# EAGLE design tricorder-sensors-mk-2.0 (EAGLE 7.5.0)
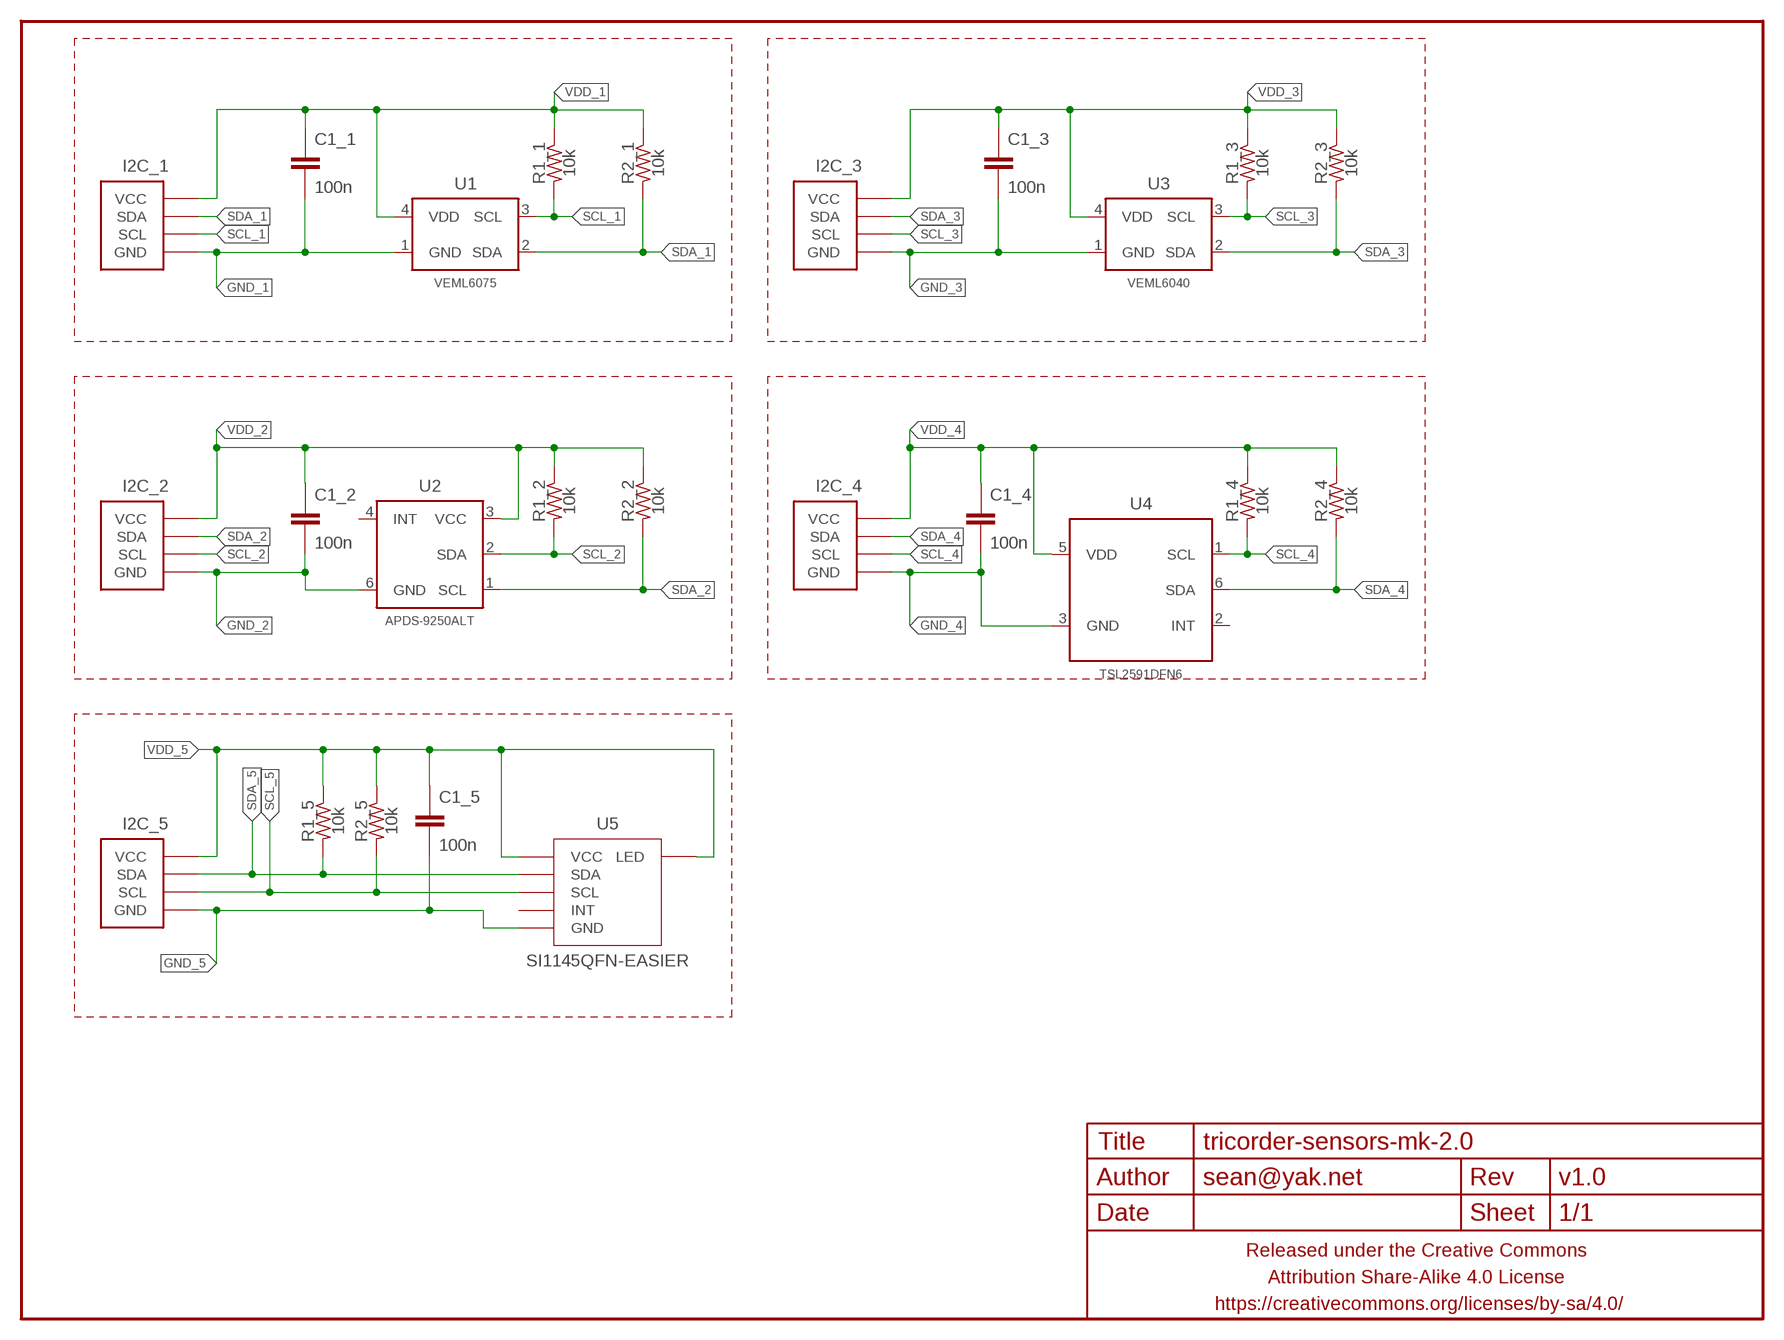
[diagram p0: schematic, sheet 1]

## Parts
C1_1  100n  CAPACITOR-CERAMICC0603  [C0603]
C1_2  100n  CAPACITOR-CERAMICC0603  [C0603]
C1_3  100n  CAPACITOR-CERAMICC0603  [C0603]
C1_4  100n  CAPACITOR-CERAMICC0603  [C0603]
C1_5  100n  CAPACITOR-CERAMICC0603  [C0603]
FRAME1  FRAME-LETTERNO_PACKAGE  [DUMMY]
I2C_1  M04-I2CPTH-0.1IN-CENTERED  [1X04-PTH-VERT-I2C-CENTERED]
I2C_2  M04-I2CPTH-0.1IN-CENTERED  [1X04-PTH-VERT-I2C-CENTERED]
I2C_3  M04-I2CPTH-0.1IN-CENTERED  [1X04-PTH-VERT-I2C-CENTERED]
I2C_4  M04-I2CPTH-0.1IN-CENTERED  [1X04-PTH-VERT-I2C-CENTERED]
I2C_5  M04-I2CPTH-0.1IN-CENTERED  [1X04-PTH-VERT-I2C-CENTERED]
R1_1  10k  RESISTORR0603  [R0603]
R1_2  10k  RESISTORR0603  [R0603]
R1_3  10k  RESISTORR0603  [R0603]
R1_4  10k  RESISTORR0603  [R0603]
R1_5  10k  RESISTORR0603  [R0603]
R2_1  10k  RESISTORR0603  [R0603]
R2_2  10k  RESISTORR0603  [R0603]
R2_3  10k  RESISTORR0603  [R0603]
R2_4  10k  RESISTORR0603  [R0603]
R2_5  10k  RESISTORR0603  [R0603]
U1  VEML6075  [OPLGA4]
U2  APDS-9250ALT  [APDS-9250-ALT]
U3  VEML6040  [OPLGA4]
U4  TSL2591DFN6  [TSL2951_DFN6]
U5  SI1145QFN-EASIER  [SI1145-ALT]

## Nets
GND_1: C1_1.2 I2C_1.GND U1.1(GND)
GND_2: C1_2.2 I2C_2.GND U2.6(GND)
GND_3: C1_3.2 I2C_3.GND U3.1(GND)
GND_4: C1_4.2 I2C_4.GND U4.3(GND)
GND_5: C1_5.2 I2C_5.GND U5.GND
SCL_1: I2C_1.SCL R1_1.2 U1.3(SCL)
SCL_2: I2C_2.SCL R1_2.2 U2.2(SDA)
SCL_3: I2C_3.SCL R1_3.2 U3.3(SCL)
SCL_4: I2C_4.SCL R1_4.2 U4.1(SCL)
SCL_5: I2C_5.SCL R2_5.2 U5.SCL
SDA_1: I2C_1.SDA R2_1.2 U1.2(SDA)
SDA_2: I2C_2.SDA R2_2.2 U2.1(SCL)
SDA_3: I2C_3.SDA R2_3.2 U3.2(SDA)
SDA_4: I2C_4.SDA R2_4.2 U4.6(SDA)
SDA_5: I2C_5.SDA R1_5.2 U5.SDA
VDD_1: C1_1.1 I2C_1.VCC R1_1.1 R2_1.1 U1.4(VDD)
VDD_2: C1_2.1 I2C_2.VCC R1_2.1 R2_2.1 U2.3(VCC)
VDD_3: C1_3.1 I2C_3.VCC R1_3.1 R2_3.1 U3.4(VDD)
VDD_4: C1_4.1 I2C_4.VCC R1_4.1 R2_4.1 U4.5(VDD)
VDD_5: C1_5.1 I2C_5.VCC R1_5.1 R2_5.1 U5.LED U5.VCC@1(VCC) U5.VCC@2(VCC)
Unconnected: U2.4(INT) U4.2(INT) U5.INT

## Library data of the parts
C1_1-C1_5 = a_parts:CAPACITOR-CERAMIC: CAPACITOR, European symbol
FRAME1 = a_parts:FRAME-LETTER: Schematic Frame Standard 8.5x11 US Letter frame; DESIGNER: sean@yak.net; VERSION: v1.0
I2C_1-I2C_5 = a_parts:M04-I2C
R1_1-R1_5 R2_1-R2_5 = a_parts:RESISTOR: RESISTOR, American symbol
U1 = a_parts:VEML6075
U2 = a_parts:APDS-9250
U3 = a_parts:VEML6040
U4 = a_parts:TSL2591
U5 = a_parts:SI1145

## Module SENSOR_VEML6075
Ports: 

### Library data of the parts

## Board
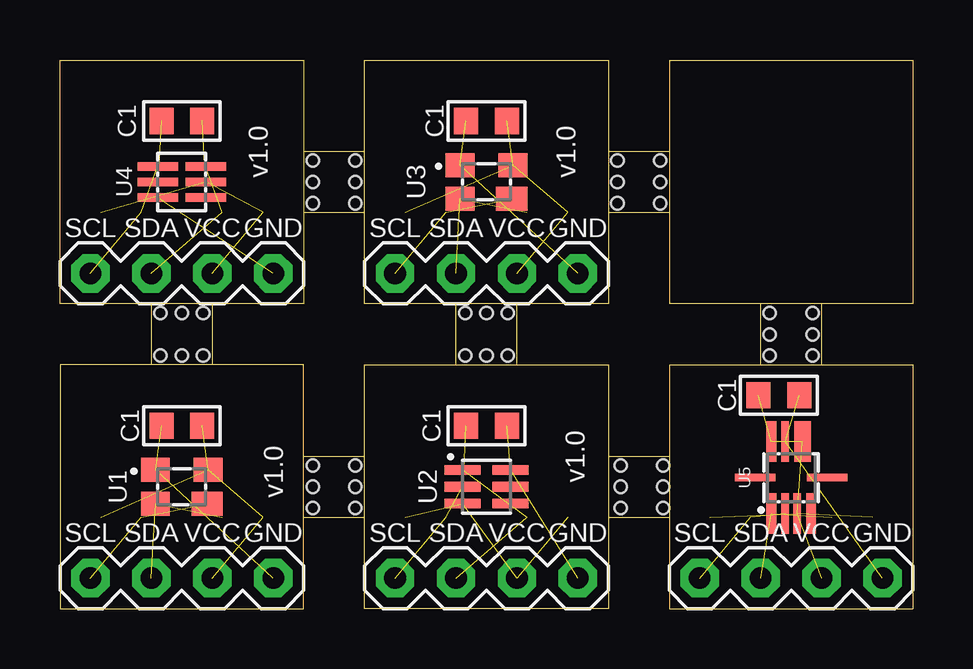
[diagram p1: board, top side]
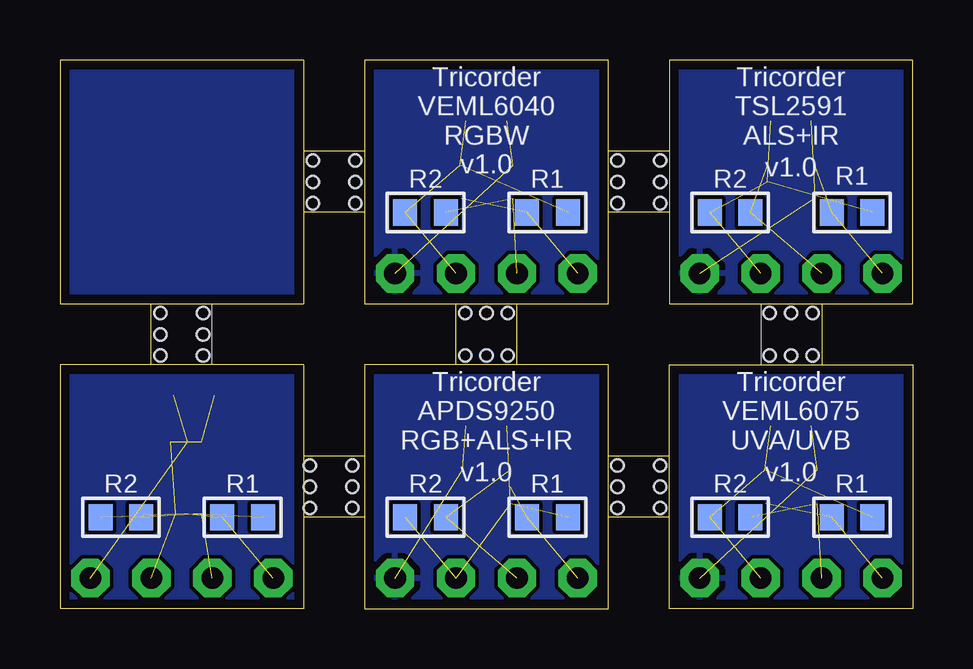
[diagram p2: board, bottom side, seen from below]

Size 35.56 x 22.86 mm. Coordinates in mm from the lower left corner, seen from the top.
Outline: 10.16,3.81 10.16,0 0,0 0,10.16 3.81,10.16
Outline: 10.16,3.81 10.16,6.35
Outline: 10.16,6.35 10.16,10.16 6.35,10.16
Outline: 6.35,10.16 3.81,10.16
Outline: 12.7,3.81 12.7,0 22.86,0 22.86,3.81
Outline: 12.7,3.81 12.7,6.35
Outline: 12.7,6.35 12.7,10.16 16.51,10.16
Outline: 16.51,10.16 19.05,10.16
Outline: 19.05,10.16 22.86,10.16 22.86,6.35
Outline: 22.86,6.35 22.86,3.81
Outline: 22.86,19.05 22.86,22.86 12.7,22.86 12.7,19.05
Outline: 22.86,19.05 22.86,16.51
Outline: 22.86,16.51 22.86,12.7 19.05,12.7
Outline: 19.05,12.7 16.51,12.7
Outline: 16.51,12.7 12.7,12.7 12.7,16.51
Outline: 12.7,16.51 12.7,19.05
Outline: 10.16,19.05 10.16,22.86 0,22.86 0,12.7 3.81,12.7
Outline: 10.16,19.05 10.16,16.51
Outline: 10.16,16.51 10.16,12.7 6.35,12.7
Outline: 6.35,12.7 3.81,12.7
Outline: 3.81,12.7 3.81,10.16
Outline: 6.35,12.7 6.35,10.16
Outline: 10.16,6.35 12.7,6.35
Outline: 10.16,3.81 12.7,3.81
Outline: 10.16,16.51 12.7,16.51
Outline: 10.16,19.05 12.7,19.05
Outline: 19.05,10.16 19.05,12.7
Outline: 16.51,10.16 16.51,12.7
Outline: 25.4,6.35 25.4,10.16 29.21,10.16
Outline: 25.4,6.35 25.4,3.81
Outline: 25.4,3.81 25.4,0 35.56,0 35.56,10.16 31.75,10.16
Outline: 29.21,10.16 31.75,10.16
Outline: 22.86,6.35 25.4,6.35
Outline: 22.86,3.81 25.4,3.81
Outline: 29.21,10.16 29.21,12.7
Outline: 31.75,10.16 31.75,12.7
Outline: 29.21,12.7 25.4,12.7 25.4,16.51
Outline: 31.75,12.7 35.56,12.7 35.56,22.86 25.4,22.86 25.4,19.05
Outline: 31.75,12.7 29.21,12.7
Outline: 25.4,19.05 25.4,16.51
Outline: 22.86,19.05 25.4,19.05
Outline: 22.86,16.51 25.4,16.51
Copper layers (1*16): Top 0.0356mm / dielectric 1.5011mm / Bottom 0.0356mm
Design rules "LaenPCBOrder2": minimum track width 6mil, minimum drill 13mil, track to track 6mil, track to pad 6mil, pad to pad 6mil, via to via 6mil, smd to smd 6mil, copper to edge 15mil, drill to drill 6mil, minimum pad ring 7mil, minimum via ring 7mil, stop-mask expansion 3mil, vias tented up to drill 20mil, thermal gap 10mil
Holes 0.51 mm at 5.08,12.32 4.19,12.32 5.97,12.32 4.19,10.54 5.08,10.54 5.97,10.54 10.54,5.08 10.54,4.19 10.54,5.97 12.32,4.19 12.32,5.08 12.32,5.97 10.54,17.78 10.54,16.89 10.54,18.67 12.32,16.89 12.32,17.78 12.32,18.67 17.78,10.54 18.67,10.54 16.89,10.54 18.67,12.32 17.78,12.32 16.89,12.32 23.37,5.08 23.37,4.19 23.37,5.97 25.15,4.19 25.15,5.08 25.15,5.97 29.59,11.43 29.59,10.54 29.59,12.32 31.37,10.54 31.37,11.43 31.37,12.32 23.24,17.78 23.24,16.89 23.24,18.67 25.02,16.89 25.02,17.78 25.02,18.67

### Footprints (pad centres in the part's own frame; a part is rotated, then mirrored left to right if it is on the bottom)
C0603 = smd 1 x 1.1: 1 -0.85,0; 2 0.85,0
1X04-PTH-VERT-I2C-CENTERED = drill 0.9 pad 1.6 octagon: GND -3.81,0; SCL 3.81,0; SDA 1.27,0; VCC -1.27,0
R0603 = smd 1 x 1.1: 1 -0.85,0; 2 0.85,0
OPLGA4 = smd 1.2 x 1: 1 -1.1,0.7; 2 -1.1,-0.7; 4 1.1,0.7 | smd 1.3 x 1: 3 1.05,-0.7
APDS-9250-ALT = smd 1.5 x 0.4: 1 -1,0.7; 2 -1,0; 3 -1,-0.7; 4 1,-0.7; 5 1,0; 6 1,0.7
TSL2951_DFN6 = smd 1.7 x 0.35: 1 -1,0.65; 2 -1,0; 3 -1,-0.65; 4 1,-0.65; 5 1,0; 6 1,0.65
SI1145-ALT = smd 1.7 x 0.3: GND 1.5,0.25; SCL -1.5,0.25; VCC@1 -1.5,-0.25 | smd 1.7 x 0.4: INT -1.5,-0.825; LED 1.5,0.825; SDA -1.5,0.825 | smd 0.3 x 1.7: NC@1 0,1.5; NC@2 0,-1.5 | smd 1.7 x 0.7: VCC@2 1.5,-0.475

### Placement (x,y rotation side)
C1_1  5.08,7.62 180 top
C1_2  17.78,7.62 0 top
C1_3  17.78,20.32 180 top
C1_4  5.08,20.32 180 top
C1_5  29.97,8.89 0 top
FRAME1  0,0 0 top
I2C_1  5.08,1.27 180 top
I2C_2  17.78,1.27 180 top
I2C_3  17.78,13.97 180 top
I2C_4  5.08,13.97 180 top
I2C_5  30.48,1.27 180 top
R1_1  2.54,3.81 180 bottom
R1_2  15.24,3.81 180 bottom
R1_3  15.24,16.51 180 bottom
R1_4  2.54,16.51 180 bottom
R1_5  33.02,3.81 0 bottom
R2_1  7.62,3.81 0 bottom
R2_2  20.32,3.81 0 bottom
R2_3  20.32,16.51 0 bottom
R2_4  7.62,16.51 0 bottom
R2_5  27.94,3.81 180 bottom
U1  5.08,5.08 0 top
U2  17.78,5.08 0 top
U3  17.78,17.78 0 top
U4  5.08,17.78 0 top
U5  30.48,5.46 90 top

### Tracks (layer width: path | path; a pad name or v marks a point on that pad's centre or on a via)
GND_1  (2 unrouted)
  pour Bottom: 0,10.16 0,0 10.16,0 10.16,10.16
GND_2  (2 unrouted)
  pour Bottom: 12.7,10.16 12.7,0 22.86,0 22.86,10.16
  pour Bottom: 25.4,10.16 25.4,0 35.56,0 35.56,10.16
GND_3  (2 unrouted)
  pour Bottom: 12.7,22.86 12.7,12.7 22.86,12.7 22.86,22.86
  pour Bottom: 25.4,22.86 25.4,12.7 35.56,12.7 35.56,22.86
GND_4  (2 unrouted)
  pour Bottom: 0,22.86 0,12.7 10.16,12.7 10.16,22.86
GND_5  (2 unrouted)
SCL_1  (2 unrouted)
SCL_2  (2 unrouted)
SCL_3  (2 unrouted)
SCL_4  (2 unrouted)
SCL_5  (2 unrouted)
SDA_1  (2 unrouted)
SDA_2  (2 unrouted)
SDA_3  (2 unrouted)
SDA_4  (2 unrouted)
SDA_5  (2 unrouted)
VDD_1  (4 unrouted)
VDD_2  (4 unrouted)
VDD_3  (4 unrouted)
VDD_4  (4 unrouted)
VDD_5  (6 unrouted)

### Text on the board
bPlace: Tricorder / TSL2591 / ALS+IR | Tricorder / VEML6040 / RGBW | Tricorder / VEML6075 / UVA/UVB | Tricorder / APDS9250 / RGB+ALS+IR
tNames: C1 | C1 | C1 | C1 | C1
bNames: R1 | R2 | R1 | R2 | R1 | R2 | R1 | R2 | R1 | R2